# Altium project SDL.PrjPcb
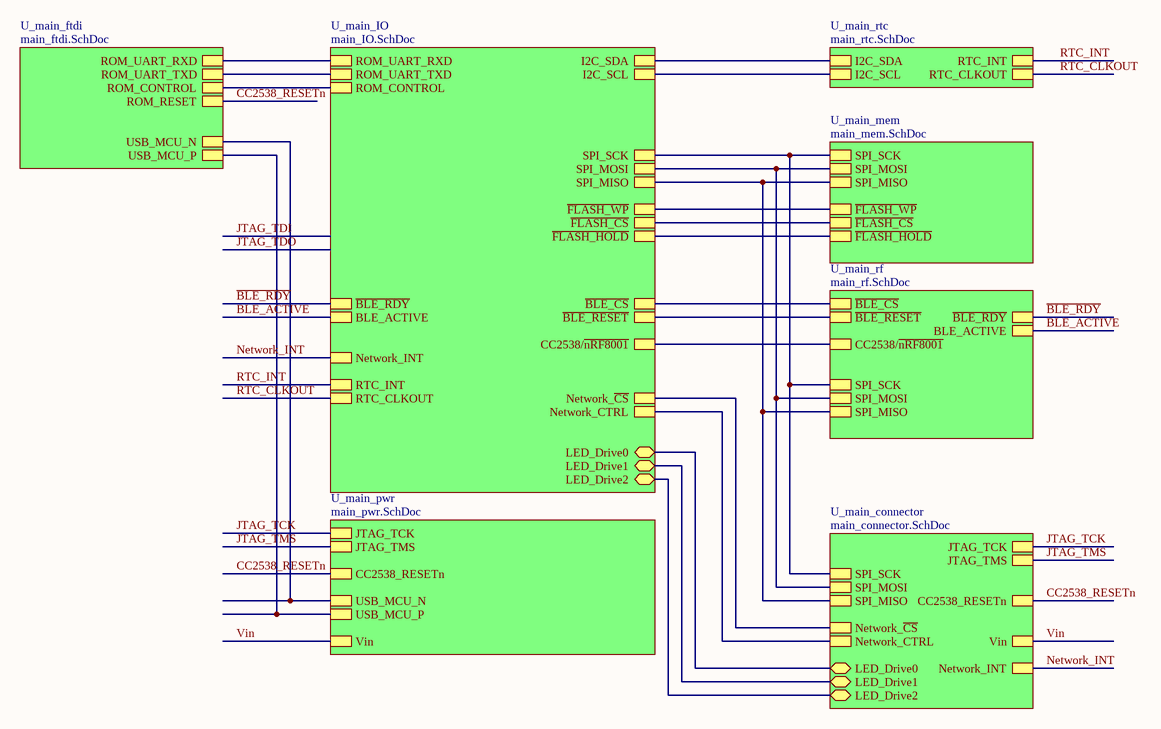
[diagram p0: main_top.SchDoc]
8 sheets, 101 parts. Net scope: hierarchical (ports join the sheet entries above them; power ports are global).
Board file: main.PcbDoc
Sheets:
  main_top.SchDoc
    U_main_connector = main_connector.SchDoc
    U_main_ftdi = main_ftdi.SchDoc
    U_main_IO = main_IO.SchDoc
    U_main_mem = main_mem.SchDoc
    U_main_pwr = main_pwr.SchDoc
    U_main_rf = main_rf.SchDoc
    U_main_rtc = main_rtc.SchDoc

## Sheet main_top.SchDoc: SDL - Main
size Letter; Author: Ye-Sheng Kuo; Revision: 1; SheetNumber: 1; SheetTotal: 8

### Sub-sheets
U_main_connector = main_connector.SchDoc: Vin, JTAG_TCK, JTAG_TMS, CC2538_RESETn, SPI_SCK, SPI_MOSI, SPI_MISO, Network_~{CS}, Network_CTRL, Network_INT, LED_Drive0, LED_Drive1, LED_Drive2
U_main_ftdi = main_ftdi.SchDoc: ROM_UART_RXD, ROM_UART_TXD, ROM_CONTROL, ROM_RESET, USB_MCU_N, USB_MCU_P
U_main_IO = main_IO.SchDoc: ROM_UART_RXD, ROM_UART_TXD, ROM_CONTROL, I2C_SDA, I2C_SCL, SPI_SCK, SPI_MOSI, SPI_MISO, ~{FLASH_WP}, ~{FLASH_CS}, ~{FLASH_HOLD}, ~{BLE_RDY}, ~{BLE_CS}, BLE_ACTIVE, ~{BLE_RESET}, RTC_INT, RTC_CLKOUT, CC2538/~{nRF8001}, Network_~{CS}, Network_CTRL, Network_INT, LED_Drive0, LED_Drive1, LED_Drive2
U_main_mem = main_mem.SchDoc: ~{FLASH_WP}, ~{FLASH_CS}, ~{FLASH_HOLD}, SPI_SCK, SPI_MOSI, SPI_MISO
U_main_pwr = main_pwr.SchDoc: Vin, CC2538_RESETn, USB_MCU_N, USB_MCU_P, JTAG_TCK, JTAG_TMS
U_main_rf = main_rf.SchDoc: SPI_SCK, SPI_MOSI, SPI_MISO, ~{BLE_RDY}, ~{BLE_CS}, BLE_ACTIVE, ~{BLE_RESET}, CC2538/~{nRF8001}
U_main_rtc = main_rtc.SchDoc: RTC_CLKOUT, I2C_SDA, I2C_SCL, RTC_INT

### Nets
~{BLE_CS}: sheet U_main_IO/~{BLE_CS}, sheet U_main_rf/~{BLE_CS}
~{BLE_RDY}: sheet U_main_IO/~{BLE_RDY}, sheet U_main_rf/~{BLE_RDY}
~{BLE_RESET}: sheet U_main_IO/~{BLE_RESET}, sheet U_main_rf/~{BLE_RESET}
BLE_ACTIVE: sheet U_main_IO/BLE_ACTIVE, sheet U_main_rf/BLE_ACTIVE
CC2538/~{nRF8001}: sheet U_main_IO/CC2538/~{nRF8001}, sheet U_main_rf/CC2538/~{nRF8001}
CC2538_RESETn: sheet U_main_connector/CC2538_RESETn, sheet U_main_ftdi/ROM_RESET, sheet U_main_pwr/CC2538_RESETn
~{FLASH_CS}: sheet U_main_IO/~{FLASH_CS}, sheet U_main_mem/~{FLASH_CS}
~{FLASH_HOLD}: sheet U_main_IO/~{FLASH_HOLD}, sheet U_main_mem/~{FLASH_HOLD}
~{FLASH_WP}: sheet U_main_IO/~{FLASH_WP}, sheet U_main_mem/~{FLASH_WP}
I2C_SCL: sheet U_main_IO/I2C_SCL, sheet U_main_rtc/I2C_SCL
I2C_SDA: sheet U_main_IO/I2C_SDA, sheet U_main_rtc/I2C_SDA
JTAG_TCK: sheet U_main_connector/JTAG_TCK, sheet U_main_pwr/JTAG_TCK
JTAG_TMS: sheet U_main_connector/JTAG_TMS, sheet U_main_pwr/JTAG_TMS
LED_Drive0: sheet U_main_connector/LED_Drive0, sheet U_main_IO/LED_Drive0
LED_Drive1: sheet U_main_connector/LED_Drive1, sheet U_main_IO/LED_Drive1
LED_Drive2: sheet U_main_connector/LED_Drive2, sheet U_main_IO/LED_Drive2
Network_~{CS}: sheet U_main_connector/Network_~{CS}, sheet U_main_IO/Network_~{CS}
Network_CTRL: sheet U_main_connector/Network_CTRL, sheet U_main_IO/Network_CTRL
Network_INT: sheet U_main_connector/Network_INT, sheet U_main_IO/Network_INT
ROM_CONTROL: sheet U_main_ftdi/ROM_CONTROL, sheet U_main_IO/ROM_CONTROL
ROM_UART_RXD: sheet U_main_ftdi/ROM_UART_RXD, sheet U_main_IO/ROM_UART_RXD
ROM_UART_TXD: sheet U_main_ftdi/ROM_UART_TXD, sheet U_main_IO/ROM_UART_TXD
RTC_CLKOUT: sheet U_main_IO/RTC_CLKOUT, sheet U_main_rtc/RTC_CLKOUT
RTC_INT: sheet U_main_IO/RTC_INT, sheet U_main_rtc/RTC_INT
SPI_MISO: sheet U_main_connector/SPI_MISO, sheet U_main_IO/SPI_MISO, sheet U_main_mem/SPI_MISO, sheet U_main_rf/SPI_MISO
SPI_MOSI: sheet U_main_connector/SPI_MOSI, sheet U_main_IO/SPI_MOSI, sheet U_main_mem/SPI_MOSI, sheet U_main_rf/SPI_MOSI
SPI_SCK: sheet U_main_connector/SPI_SCK, sheet U_main_IO/SPI_SCK, sheet U_main_mem/SPI_SCK, sheet U_main_rf/SPI_SCK
USB_MCU_N: sheet U_main_ftdi/USB_MCU_N, sheet U_main_pwr/USB_MCU_N
USB_MCU_P: sheet U_main_ftdi/USB_MCU_P, sheet U_main_pwr/USB_MCU_P
Vin: sheet U_main_connector/Vin, sheet U_main_pwr/Vin

### Notes on the sheet
- Title
- Date:
- Author:
- Revision:
- Sheet
- of
- University of Michigan
- File:

## Sheet main_connector.SchDoc: SDL - Main
size Letter; Author: Ye-Sheng Kuo; Revision: 1; SheetNumber: 6; SheetTotal: 8
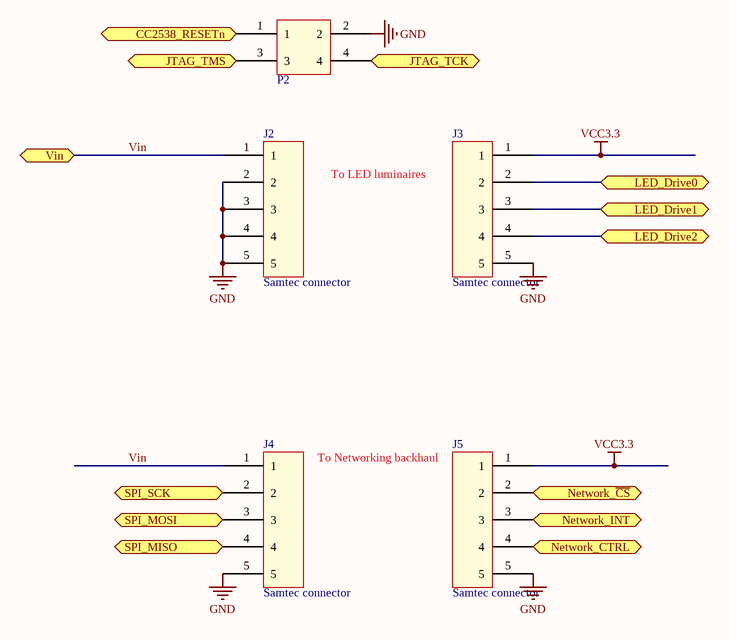
[diagram p1: main_connector.SchDoc]

### Parts
J2  Samtec connector  [SFM-105-02-L-S]
J3  Samtec connector  [SFM-105-02-L-S]
J4  Samtec connector  [SFM-105-02-L-S]
J5  Samtec connector  [SFM-105-02-L-S]
P2  2 x 2 header SMD  [2x2 header SMD]  (value not drawn)

### Ports
CC2538_RESETn, JTAG_TCK, JTAG_TMS, LED_Drive0, LED_Drive1, LED_Drive2, Network_CTRL, Network_INT, Network_~{CS}, SPI_MISO, SPI_MOSI, SPI_SCK, Vin

### Nets
GND: J2.2 J2.3 J2.4 J2.5 J3.5 J4.5 J5.5 P2.2
VCC3.3: J3.1 J5.1
CC2538_RESETn: P2.1 ; port CC2538_RESETn
JTAG_TCK: P2.4 ; port JTAG_TCK
JTAG_TMS: P2.3 ; port JTAG_TMS
LED_Drive0: J3.2 ; port LED_Drive0
LED_Drive1: J3.3 ; port LED_Drive1
LED_Drive2: J3.4 ; port LED_Drive2
Network_~{CS}: J5.2 ; port Network_~{CS}
Network_CTRL: J5.4 ; port Network_CTRL
Network_INT: J5.3 ; port Network_INT
SPI_MISO: J4.4 ; port SPI_MISO
SPI_MOSI: J4.3 ; port SPI_MOSI
SPI_SCK: J4.2 ; port SPI_SCK
Vin: J2.1 J4.1 ; port Vin

### Notes on the sheet
- To LED luminaires
- To Networking backhaul
- Title
- Date:
- Author:
- Revision:
- Sheet
- of
- University of Michigan
- File:

### Library data of the parts
J2-J5 = Samtec conntector: Samtec connector, 1.27 mm, single row, 5 pos SMD; Supplier 1: Samtec
P2 = 2 x 2 header SMD: 2x2 100 mil header SMD; Supplier 1: Digi-Key; Supplier Part Number 1: 609-4463-6-ND

## Sheet main_ftdi.SchDoc: SDL - Main
size Letter; Author: Ye-Sheng Kuo; Revision: 1; SheetNumber: 5; SheetTotal: 8
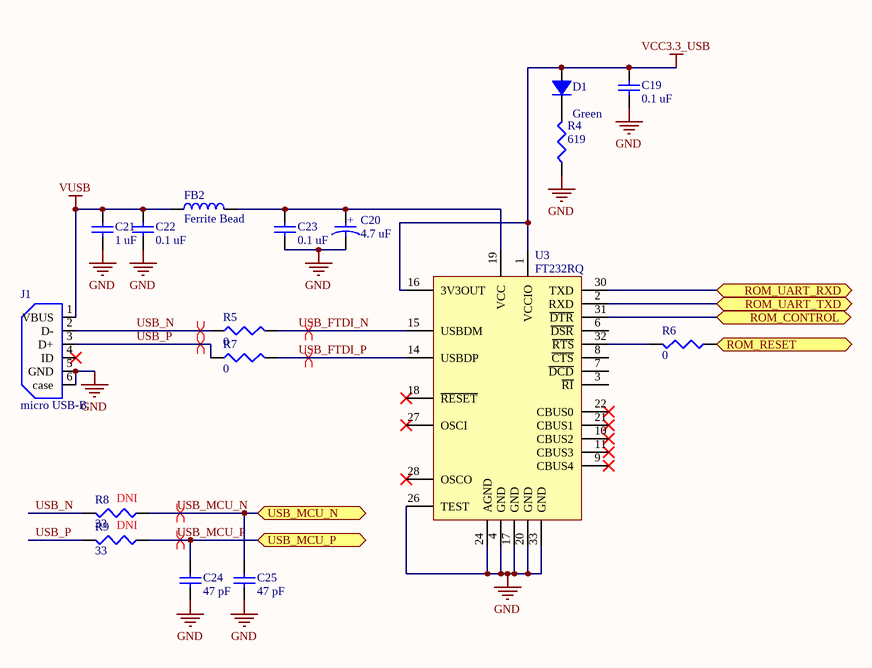
[diagram p2: main_ftdi.SchDoc]

### Parts
C19  value 0.1 uF  [0402]  (hidden comment: Ceramic capacitor)
C20  value 4.7 uF  [0603 - Polar Marking]  (hidden comment: Tantalum capacitor)
C21  value 1 uF  [0402]  (hidden comment: Ceramic capacitor)
C22  value 0.1 uF  [0402]  (hidden comment: Ceramic capacitor)
C23  value 0.1 uF  [0402]  (hidden comment: Ceramic capacitor)
C24  value 47 pF  [0402]  (hidden comment: Ceramic capacitor)
C25  value 47 pF  [0402]  (hidden comment: Ceramic capacitor)
D1  Color: Green  [0402 - DIODE]  (hidden comment: LED, Green)
FB2  Ferrite Bead  [0402]
J1  micro USB-B  [Micro USB-B]
R4  value 619  [0402]  (hidden comment: Chip resistor)
R5  value 0  [0402]  (hidden comment: Chip resistor)
R6  value 0  [0402]  (hidden comment: Chip resistor)
R7  value 0  [0402]  (hidden comment: Chip resistor)
R8  value 33  [0402]  (hidden comment: Chip resistor)
R9  value 33  [0402]  (hidden comment: Chip resistor)
U3  FT232RQ  [QFN-32]

### Ports
ROM_CONTROL, ROM_RESET, ROM_UART_RXD, ROM_UART_TXD, USB_MCU_N, USB_MCU_P

### Nets
GND: C19.2 C20.2 C21.2 C22.2 C23.2 C24.2 C25.2 J1.5(GND) J1.6(case) R4.2 U3.4(GND) U3.17(GND) U3.20(GND) U3.24(AGND) U3.26(TEST) U3.33(GND)
VCC3.3_USB: C19.1 D1.1 U3.1(VCCIO) U3.16(3V3OUT)
VUSB: C21.1 C22.1 FB2.2 J1.1(VBUS)
CC2538_RESETn: R6.2 ; port ROM_RESET
ROM_CONTROL: U3.31(~{DTR}) ; port ROM_CONTROL
ROM_UART_RXD: U3.30(TXD) ; port ROM_UART_RXD
ROM_UART_TXD: U3.2(RXD) ; port ROM_UART_TXD
USB_FTDI_N: R5.1 U3.15(USBDM)
USB_FTDI_P: R7.1 U3.14(USBDP)
USB_MCU_N: C25.1 R8.2 ; port USB_MCU_N
USB_MCU_P: C24.1 R9.2 ; port USB_MCU_P
USB_N: J1.2(D-) R5.2 R8.1
USB_P: J1.3(D+) R7.2 R9.1
NetC20_1: C20.1 C23.1 FB2.1 U3.19(VCC)
NetD1_2: D1.2 R4.1
NetR6_1: R6.1 U3.32(~{RTS})

Not connected (* = marked no-connect by the designer): J1 4(ID)*; U3 3(~{RI}) 6(~{DSR}) 7(~{DCD}) 8(~{CTS}) 9(CBUS4)* 10(CBUS2)* 11(CBUS3)* 18(~{RESET})* 21(CBUS1)* 22(CBUS0)* 27(OSCI)* 28(OSCO)*

### Layout directives
differential pair: USB_FTDI_N, USB_FTDI_P, USB_MCU_N, USB_MCU_P, USB_N, USB_P

### Notes on the sheet
- (near R8) DNI
- DNI
- Title
- Date:
- Author:
- Revision:
- Sheet
- of
- University of Michigan
- File:
- (in symbol C_4.7u_0603_tantalum) +

### Library data of the parts
C19 C22 C23 = C_0.1u_0402_ceramic: Ceramic capacitor, 0.1u, 0402 package; Manufacture: TDK; voltage rated: 10 V; tolerance: 10%; Supplier 1: Digi-Key; Supplier Part Number 1: 445-1265-1-ND; package: 0402
C20 = C_4.7u_0603_tantalum: Tantalum capacitor, 4.7 uF, 0603 package; Manufacture: Rohm; voltage rated: 10 V; tolerance: 20%; package: 0603; Supplier 1: Digi-Key; Supplier Part Number 1: 511-1496-1-ND
C21 = C_1u_0402_ceramic: Ceramic capacitor, 1 uF, 0402 package; Manufacture: TDK; voltage rated: 6.3 V; tolerance: 10%; package: 0402; Supplier 1: Digi-Key; Supplier Part Number 1: 445-5000-1-ND
C24 C25 = C_47p_0402_ceramic: Ceramic capacitor, 47 pF, 0402 package; Manufacture: Johanson; voltage rated: 50 V; tolerance: 5%; package: 0402; Supplier 1: Digi-Key; Supplier Part Number 1: 709-1121-1-ND
D1 = D_LED_GREEN_0402: LED, Green,  0402; package: 0402; Supplier 1: Digi-Key; Supplier Part Number 1: 511-1592-1-ND
FB2 = FB_150mA_0402: Ferrite Bead, 150 mA, 0402 package; impedance@Freq: 1K@100 MHz; current rating: 150 mA; Supplier 1: Digi-Key; Supplier Part Number 1: 587-1835-1-ND; package: 0402
J1 = Micro USB: CONN USB MICRO B RECPT SMT R/A; Supplier 1: Digi-Key; Supplier Part Number 1: 609-4616-6-ND
R4 = R_619_0402: Chip resistor, 619, 0402 package; tolerance: 1%; power: 1/16 W; package: 0402; Supplier 1: Digi-Key; Supplier Part Number 1: 541-619LCT-ND
R5-R7 = R_0_0402: Chip resistor, 0, 0402 package; package: 0402; Supplier 1: Digi-Key; Supplier Part Number 1: 541-0.0YBCT-ND
R8 R9 = R_33_0402: Chip resistor, 33, 0402 package; tolerance: 1%; power: 1/16 W; package: 0402; Supplier 1: Digi-Key; Supplier Part Number 1: 541-33.0LCT-ND
U3 = FT232RQ: FT232R USB UART; Manufacturer: *; Note: *; ManufacturerPartNo: *; Supplier 1: Digi-Key; Supplier Part Number 1: 768-1008-1-ND

## Sheet main_IO.SchDoc: SDL - Main
size Letter; Author: Ye-Sheng Kuo; Revision: 1; SheetNumber: 4; SheetTotal: 8
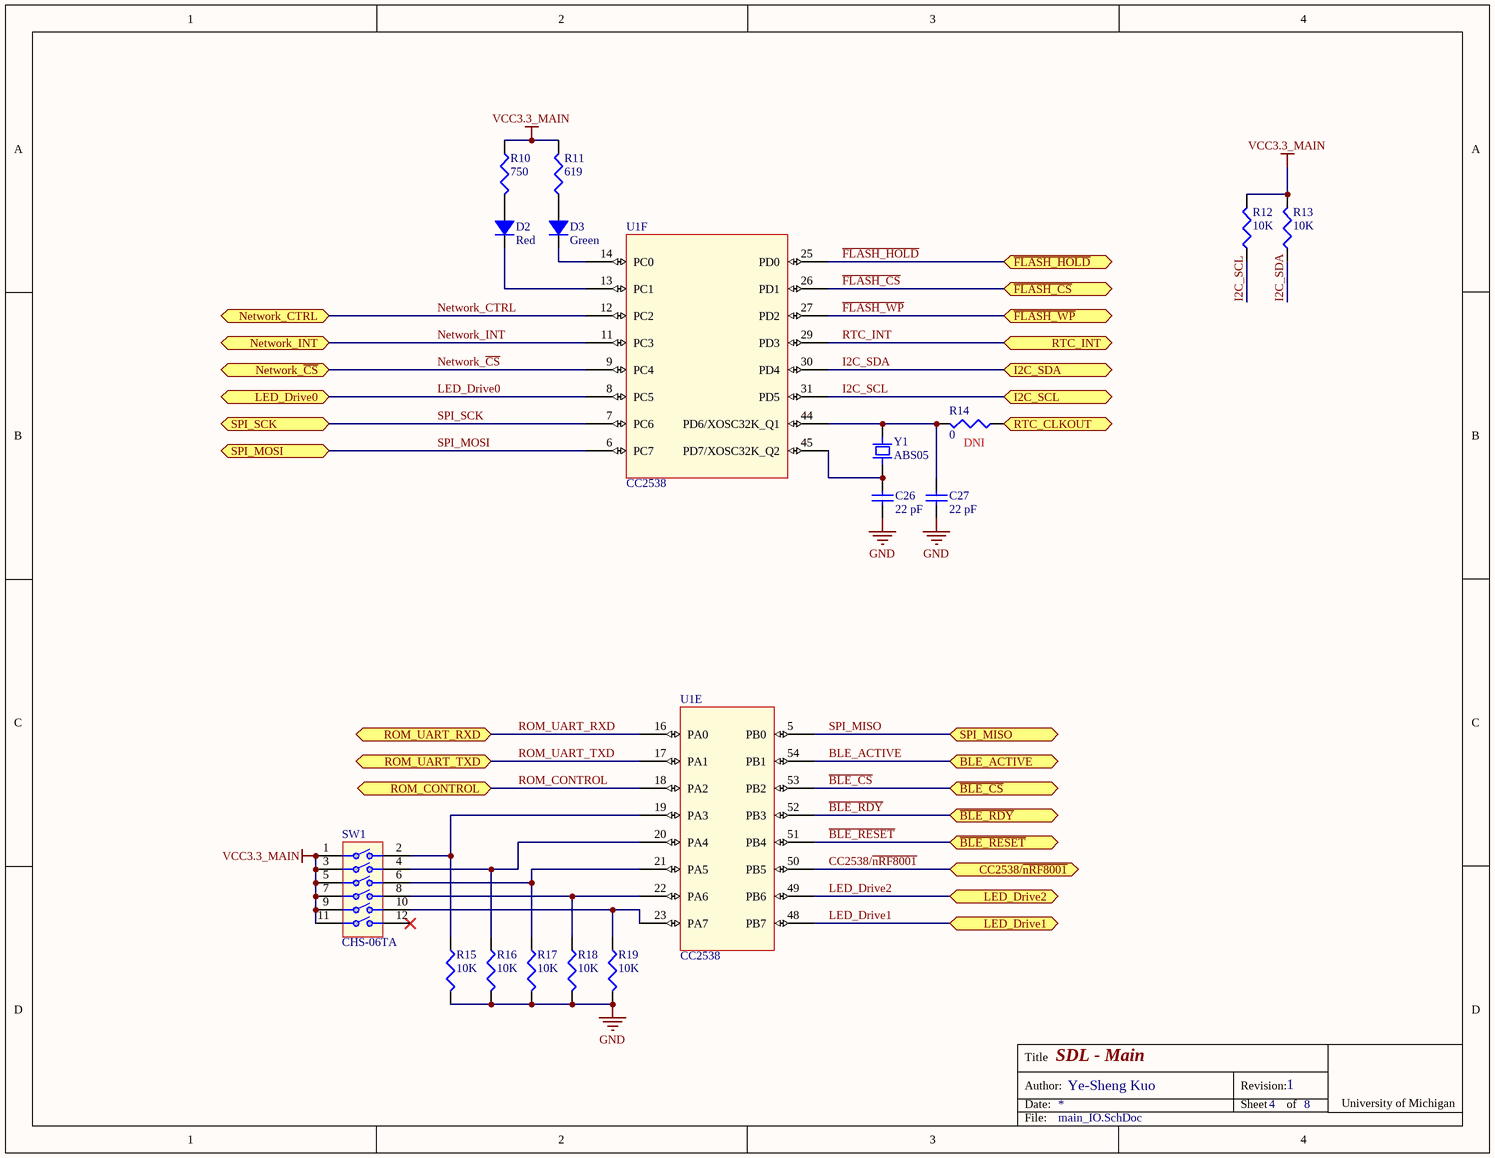
[diagram p3: main_IO.SchDoc]

### Parts
C26  value 22 pF  [0402]  (hidden comment: Ceramic capacitor)
C27  value 22 pF  [0402]  (hidden comment: Ceramic capacitor)
D2  Color: Red  [0402 - DIODE]  (hidden comment: LED, Red)
D3  Color: Green  [0402 - DIODE]  (hidden comment: LED, Green)
R10  value 750  [0402]  (hidden comment: Chip resistor)
R11  value 619  [0402]  (hidden comment: Chip resistor)
R12  value 10K  [0402]  (hidden comment: Chip resistor)
R13  value 10K  [0402]  (hidden comment: Chip resistor)
R14  value 0  [0402]  (hidden comment: Chip resistor)
R15  value 10K  [0402]  (hidden comment: Chip resistor)
R16  value 10K  [0402]  (hidden comment: Chip resistor)
R17  value 10K  [0402]  (hidden comment: Chip resistor)
R18  value 10K  [0402]  (hidden comment: Chip resistor)
R19  value 10K  [0402]  (hidden comment: Chip resistor)
SW1  CHS-06TA  [CHS-06TA]
U1  CC2538  [QFN56]  (parts E,F of 6)
Y1  ABS05  [ABS05]

### Ports
BLE_ACTIVE, CC2538/~{nRF8001}, I2C_SCL, I2C_SDA, LED_Drive0, LED_Drive1, LED_Drive2, Network_CTRL, Network_INT, Network_~{CS}, ROM_CONTROL, ROM_UART_RXD, ROM_UART_TXD, RTC_CLKOUT, RTC_INT, SPI_MISO, SPI_MOSI, SPI_SCK, ~{BLE_CS}, ~{BLE_RDY}, ~{BLE_RESET}, ~{FLASH_CS}, ~{FLASH_HOLD}, ~{FLASH_WP}

### Nets
GND: C26.2 C27.2 R15.1 R16.1 R17.1 R18.1 R19.1
VCC3.3_MAIN: R10.2 R11.1 R12.1 R13.1 SW1.1 SW1.3 SW1.5 SW1.7 SW1.9 SW1.11
~{BLE_CS}: U1.53(PB2) ; port ~{BLE_CS}
~{BLE_RDY}: U1.52(PB3) ; port ~{BLE_RDY}
~{BLE_RESET}: U1.51(PB4) ; port ~{BLE_RESET}
BLE_ACTIVE: U1.54(PB1) ; port BLE_ACTIVE
CC2538/~{nRF8001}: U1.50(PB5) ; port CC2538/~{nRF8001}
~{FLASH_CS}: U1.26(PD1) ; port ~{FLASH_CS}
~{FLASH_HOLD}: U1.25(PD0) ; port ~{FLASH_HOLD}
~{FLASH_WP}: U1.27(PD2) ; port ~{FLASH_WP}
I2C_SCL: R12.2 U1.31(PD5) ; port I2C_SCL
I2C_SDA: R13.2 U1.30(PD4) ; port I2C_SDA
LED_Drive0: U1.8(PC5) ; port LED_Drive0
LED_Drive1: U1.48(PB7) ; port LED_Drive1
LED_Drive2: U1.49(PB6) ; port LED_Drive2
Network_~{CS}: U1.9(PC4) ; port Network_~{CS}
Network_CTRL: U1.12(PC2) ; port Network_CTRL
Network_INT: U1.11(PC3) ; port Network_INT
ROM_CONTROL: U1.18(PA2) ; port ROM_CONTROL
ROM_UART_RXD: U1.16(PA0) ; port ROM_UART_RXD
ROM_UART_TXD: U1.17(PA1) ; port ROM_UART_TXD
RTC_CLKOUT: R14.2 ; port RTC_CLKOUT
RTC_INT: U1.29(PD3) ; port RTC_INT
SPI_MISO: U1.5(PB0) ; port SPI_MISO
SPI_MOSI: U1.6(PC7) ; port SPI_MOSI
SPI_SCK: U1.7(PC6) ; port SPI_SCK
NetC26_1: C26.1 U1.45(PD7/XOSC32K_Q2) Y1.2
NetC27_1: C27.1 R14.1 U1.44(PD6/XOSC32K_Q1) Y1.1
NetD2_1: D2.1 R10.1
NetD2_2: D2.2 U1.13(PC1)
NetD3_1: D3.1 R11.2
NetD3_2: D3.2 U1.14(PC0)
NetR15_2: R15.2 SW1.2 U1.19(PA3)
NetR16_2: R16.2 SW1.4 U1.20(PA4)
NetR17_2: R17.2 SW1.6 U1.21(PA5)
NetR18_2: R18.2 SW1.8 U1.22(PA6)
NetR19_2: R19.2 SW1.10 U1.23(PA7)

Not connected (* = marked no-connect by the designer): SW1 12*

### Notes on the sheet
- (near R14) DNI
- Title
- Date:
- Author:
- Revision:
- Sheet
- of
- University of Michigan
- File:

### Library data of the parts
C26 C27 = C_22p_0402_ceramic: Ceramic capacitor, 22 pF, 0402 package; Manufacture: Johanson; voltage rated: 50 V; tolerance: 2%; package: 0402; Supplier 1: Digi-Key; Supplier Part Number 1: 712-1274-1-ND
D2 = D_LED_RED_0402: LED, Red, 0402; package: 0402; Supplier 1: Digi-Key; Supplier Part Number 1: 511-1593-1-ND
D3 = D_LED_GREEN_0402: LED, Green,  0402; package: 0402; Supplier 1: Digi-Key; Supplier Part Number 1: 511-1592-1-ND
R10 = R_750_0402: Chip resistor, 750, 0402 package; tolerance: 1%; power: 1/16 W; package: 0402; Supplier 1: Digi-Key; Supplier Part Number 1: 541-750LCT-ND
R11 = R_619_0402: as R4 on sheet main_ftdi; package: 0402; Supplier 1: Digi-Key; Supplier Part Number 1: 541-619LCT-ND
R12 R13 R15-R19 = R_10K_0402: Chip resistor, 10K, 0402 package; tolerance: 1%; power: 1/16 W; Supplier 1: Digi-Key; Supplier Part Number 1: 541-10.0KLDKR-ND; package: 0402
R14 = R_0_0402: Chip resistor, 0, 0402 package; package: 0402; Supplier 1: Digi-Key; Supplier Part Number 1: 541-0.0YBCT-ND
SW1 = CHS-06TA: SLIDE SWITCHES; Supplier 1: Digi-Key; Supplier Part Number 1: 563-1009-1-ND
U1 = CC2538: A Powerful System-On-Chip for 2.4-GHz IEEE 802.15.4, 6LoWPAN  and ZigBee Applications; Supplier 1: Digi-Key; Supplier Part Number 1: 296-35797-1-ND
Y1 = ABS05: 32768 Hz SMD Low profile crystal; Supplier 1: Digi-Key; Supplier Part Number 1: 535-11899-1-ND

## Sheet main_mem.SchDoc: SDL - Main
size Letter; Author: Ye-Sheng Kuo; Revision: 1; SheetNumber: 8; SheetTotal: 8
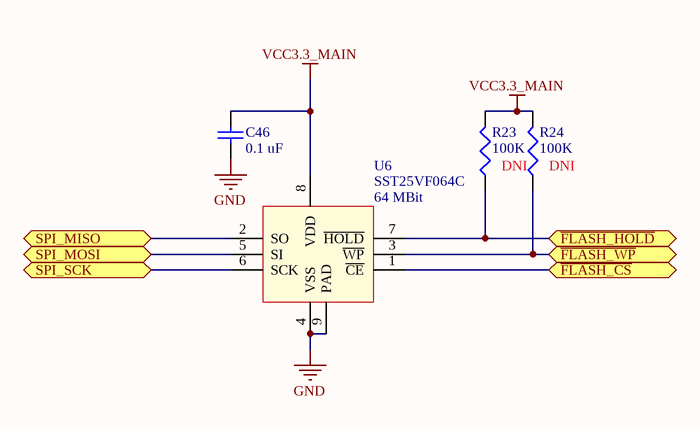
[diagram p4: main_mem.SchDoc]

### Parts
C46  value 0.1 uF  [0402]  (hidden comment: Ceramic capacitor)
R23  value 100K  [0402]  (hidden comment: Chip resistor)
R24  value 100K  [0402]  (hidden comment: Chip resistor)
U6  SST25VF064C  Capacity: 64 MBit  [WSON]

### Ports
SPI_MISO, SPI_MOSI, SPI_SCK, ~{FLASH_CS}, ~{FLASH_HOLD}, ~{FLASH_WP}

### Nets
GND: C46.2 U6.4(VSS) U6.9(PAD)
VCC3.3_MAIN: C46.1 R23.1 R24.1 U6.8(VDD)
~{FLASH_CS}: U6.1(~{CE}) ; port ~{FLASH_CS}
~{FLASH_HOLD}: R23.2 U6.7(~{HOLD}) ; port ~{FLASH_HOLD}
~{FLASH_WP}: R24.2 U6.3(~{WP}) ; port ~{FLASH_WP}
SPI_MISO: U6.2(SO) ; port SPI_MISO
SPI_MOSI: U6.5(SI) ; port SPI_MOSI
SPI_SCK: U6.6(SCK) ; port SPI_SCK

### Notes on the sheet
- DNI
- (near R24) DNI
- Title
- Date:
- Author:
- Revision:
- Sheet
- of
- University of Michigan
- File:

### Library data of the parts
C46 = C_0.1u_0402_ceramic: as C19 on sheet main_ftdi; Supplier 1: Digi-Key; Supplier Part Number 1: 445-1265-1-ND; package: 0402
R23 R24 = R_100K_0402: Chip resistor, 100K, 0402 package; tolerance: 1%; power: 1/16 W; Supplier 1: Digi-Key; Supplier Part Number 1: 541-100KLCT-ND; package: 0402
U6 = SST25VF064C: 64 Mbit SPI Serial Dual I/O Flash; Supplier 1: Digi-Key; Supplier Part Number 1: SST25VF064C-80-4I-Q2AE-CT-ND

## Sheet main_pwr.SchDoc: SDL - Main
size Letter; Author: Ye-Sheng Kuo; Revision: 1; SheetNumber: 2; SheetTotal: 8
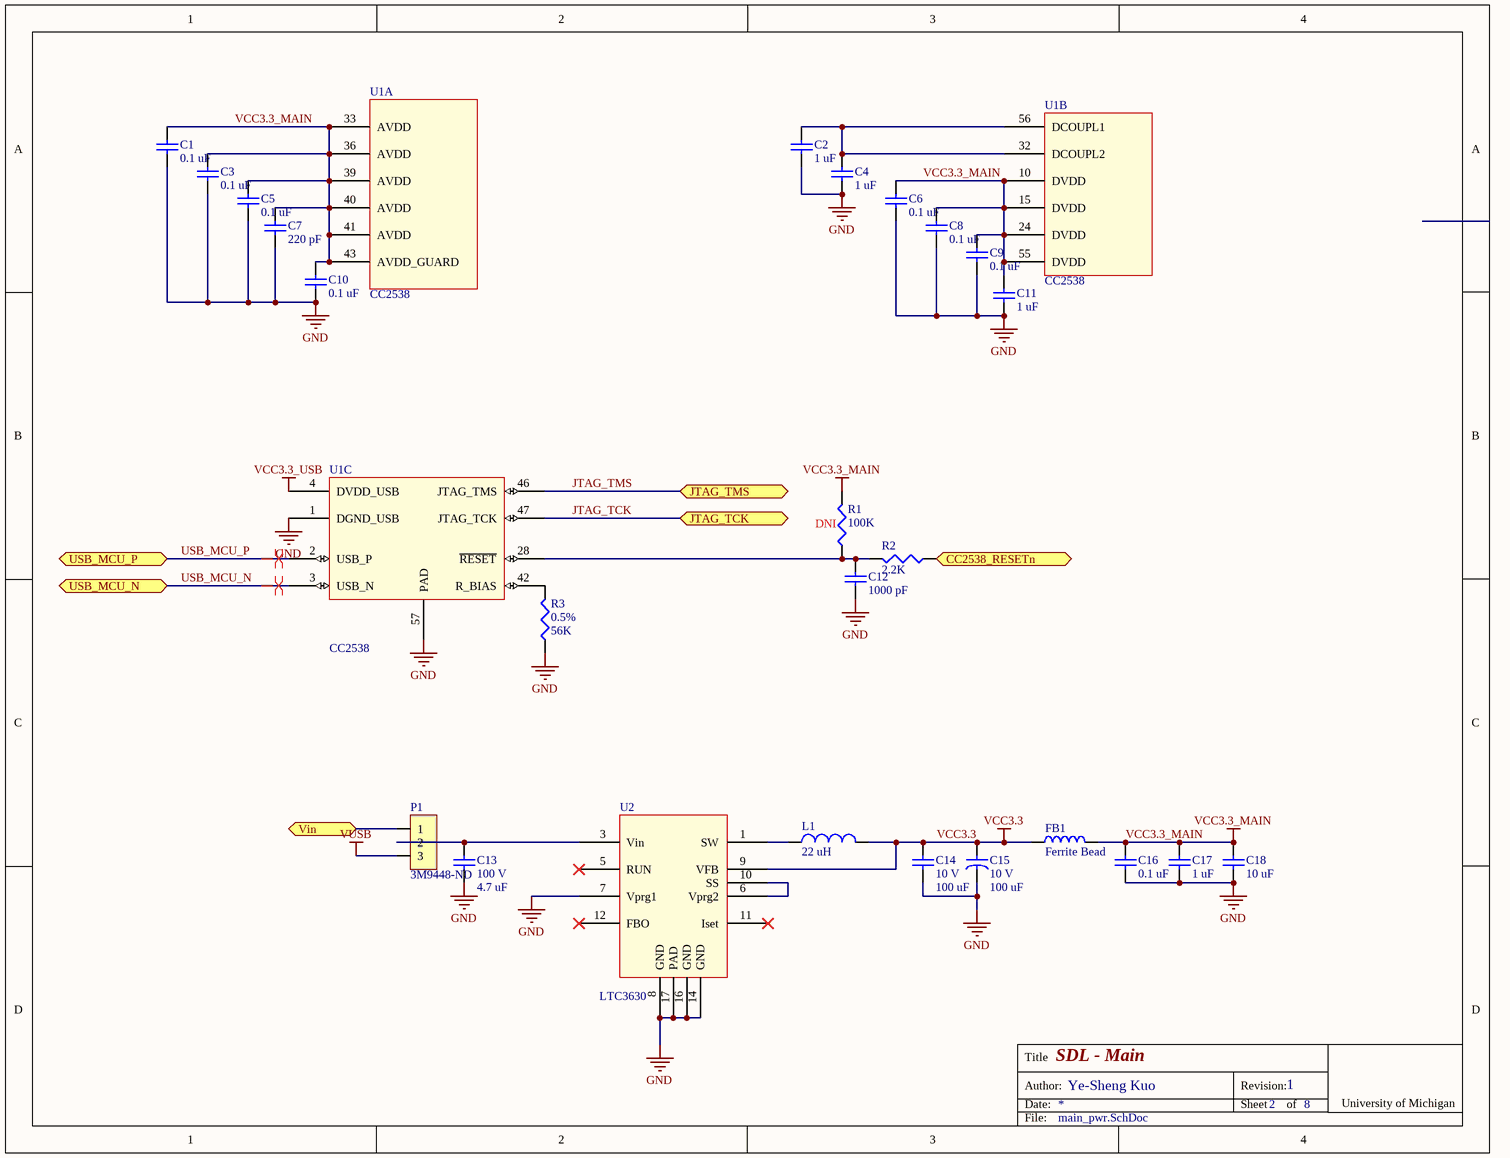
[diagram p5: main_pwr.SchDoc]

### Parts
C1  value 0.1 uF  [0402]  (hidden comment: Ceramic capacitor)
C2  value 1 uF  [0402]  (hidden comment: Ceramic capacitor)
C3  value 0.1 uF  [0402]  (hidden comment: Ceramic capacitor)
C4  value 1 uF  [0402]  (hidden comment: Ceramic capacitor)
C5  value 0.1 uF  [0402]  (hidden comment: Ceramic capacitor)
C6  value 0.1 uF  [0402]  (hidden comment: Ceramic capacitor)
C7  value 220 pF  [0402]  (hidden comment: Ceramic capacitor)
C8  value 0.1 uF  [0402]  (hidden comment: Ceramic capacitor)
C9  value 0.1 uF  [0402]  (hidden comment: Ceramic capacitor)
C10  value 0.1 uF  [0402]  (hidden comment: Ceramic capacitor)
C11  value 1 uF  [0402]  (hidden comment: Ceramic capacitor)
C12  value 1000 pF  [0402]  (hidden comment: Ceramic capacitor)
C13  value 4.7 uF  voltage rated: 100 V  [2220]  (hidden comment: Ceramic capacitor)
C14  value 100 uF  voltage rated: 10 V  [1210]  (hidden comment: Ceramic capacitor)
C15  value 100 uF  voltage rated: 10 V  [2917]  (hidden comment: Ceramic capacitor)
C16  value 0.1 uF  [0402]  (hidden comment: Ceramic capacitor)
C17  value 1 uF  [0402]  (hidden comment: Ceramic capacitor)
C18  value 10 uF  [0603]  (hidden comment: Ceramic capacitor)
FB1  Ferrite Bead  [0402]
L1  value 22 uH  [SLF10145]  (hidden comment: L_22uH_SLF10145)
P1  Supplier Part Number 1: 3M9448-ND  [1x3 header]  (hidden comment: 1 x 3 header)
R1  value 100K  [0402]  (hidden comment: Chip resistor)
R2  value 2.2K  [0402]  (hidden comment: Chip resistor)
R3  value 56K  tolerance: 0.5%  [0402]  (hidden comment: Chip resistor)
U1  CC2538  [QFN56]  (parts A,B,C of 6)
U2  LTC3630  [MSE16(12)]

### Ports
CC2538_RESETn, JTAG_TCK, JTAG_TMS, USB_MCU_N, USB_MCU_P, Vin

### Nets
GND: C1.2 C2.2 C3.2 C4.2 C5.2 C6.2 C7.2 C8.2 C9.2 C10.2 C11.2 C12.2 C13.2 C14.2 C15.2 C16.2 C17.2 C18.2 R3.2 U1.1(DGND_USB) U1.57(PAD) U2.7(Vprg1) U2.8(GND) U2.14(GND) U2.16(GND) U2.17(PAD)
VCC3.3: C14.1 C15.1 FB1.2 L1.1 U2.9(VFB)
VCC3.3_MAIN: C1.1 C3.1 C5.1 C6.1 C7.1 C8.1 C9.1 C10.1 C11.1 C16.1 C17.1 C18.1 FB1.1 R1.1 U1.10(DVDD) U1.15(DVDD) U1.24(DVDD) U1.33(AVDD) U1.36(AVDD) U1.39(AVDD) U1.40(AVDD) U1.41(AVDD) U1.43(AVDD_GUARD) U1.55(DVDD)
VCC3.3_USB: U1.4(DVDD_USB)
VUSB: P1.3
CC2538_RESETn: R2.2 ; port CC2538_RESETn
JTAG_TCK: U1.47(JTAG_TCK) ; port JTAG_TCK
JTAG_TMS: U1.46(JTAG_TMS) ; port JTAG_TMS
USB_MCU_N: U1.3(USB_N) ; port USB_MCU_N
USB_MCU_P: U1.2(USB_P) ; port USB_MCU_P
Vin: P1.1 ; port Vin
NetC2_1: C2.1 C4.1 U1.32(DCOUPL2) U1.56(DCOUPL1)
NetC12_1: C12.1 R1.2 R2.1 U1.28(~{RESET})
NetC13_1: C13.1 P1.2 U2.3(Vin)
NetL1_2: L1.2 U2.1(SW)
NetR3_1: R3.1 U1.42(R_BIAS)
NetU2_6: U2.6(Vprg2) U2.10(SS)

Not connected (* = marked no-connect by the designer): U2 5(RUN)* 11(Iset)* 12(FBO)*

### Layout directives
differential pair: USB_MCU_N, USB_MCU_P

### Notes on the sheet
- (near R1) DNI
- Title
- Date:
- Author:
- Revision:
- Sheet
- of
- University of Michigan
- File:

### Library data of the parts
C1 C3 C5 C6 C8-C10 C16 = C_0.1u_0402_ceramic: as C19 on sheet main_ftdi; Supplier 1: Digi-Key; Supplier Part Number 1: 445-1265-1-ND; package: 0402
C2 C4 C11 C17 = C_1u_0402_ceramic: as C21 on sheet main_ftdi; package: 0402; Supplier 1: Digi-Key; Supplier Part Number 1: 445-5000-1-ND
C7 = C_220p_0402_ceramic: Ceramic capacitor, 220 pF, 0402 package; Manufacture: Johanson; voltage rated: 50 V; tolerance: 10%; package: 0402; Temperature: X7R; Supplier 1: Digi-Key; Supplier Part Number 1: 445-1254-1-ND
C12 = C_1000p_0402_ceramic: Ceramic capacitor, 1000 pF, 0402 package; Manufacture: TDK; voltage rated: 50 V; tolerance: 10%; package: 0402; Supplier 1: Digi-Key; Supplier Part Number 1: 445-6846-1-ND
C13 = C_4.7u_2220_ceramic: Ceramic capacitor, 4.7u, 2220 package; Manufacture: TDK; tolerance: 20%; Temp rating: X7R; package: 2220; Supplier 1: Digi-Key; Supplier Part Number 1: 445-1450-1-ND
C14 = C_100u_1210_ceramic: Ceramic capacitor, 100u, 1210 package; Manufacture: Samsung; tolerance: 20%; package: 2917; Supplier 1: Digi-Key; Supplier Part Number 1: 1276-3364-1-ND
C15 = C_100u_2917_tantalum: Tantalum capacitor, 100u, 2917 package; Manufacture: Kemet; tolerance: 10%; package: 2917; Supplier 1: Digi-Key; Supplier Part Number 1: 399-3769-1-ND
C18 = C_10u_0603_ceramic: Ceramic capacitor, 10 uF, 0603 package; Manufacture: TDK; voltage rated: 6.3V; tolerance: 20%; package: 0603; Supplier 1: Digi-Key; Supplier Part Number 1: 445-4112-1-ND
FB1 = FB_150mA_0402: as FB2 on sheet main_ftdi; Supplier 1: Digi-Key; Supplier Part Number 1: 587-1835-1-ND; package: 0402
L1 = L_22uH_SLF10145: Inductor, 22 uH, TDK SLF10145; Saturation current: 2.1 A; Supplier 1: Digi-Key; Supplier Part Number 1: 445-1981-1-ND
P1 = 1 x 3 header: 100 mils standard header; Supplier 1: Digi-Key
R1 = R_100K_0402: as R23 on sheet main_mem; Supplier 1: Digi-Key; Supplier Part Number 1: 541-100KLCT-ND; package: 0402
R2 = R_2.2K_0402: Chip resistor, 2.2K, 0402 package; tolerance: 1%; power: 1/16 W; package: 0402; Supplier 1: Digi-Key; Supplier Part Number 1: 541-2.20KLCT-ND
R3 = R_56K_0402: Chip resistor, 56K, 0402 package; power: 1/16 W; Temperature coefficient: 25 ppm/C; package: 0402; Supplier 1: Digi-Key; Supplier Part Number 1: P56KDECT-ND
U1 = CC2538: as U1 on sheet main_IO; Supplier 1: Digi-Key; Supplier Part Number 1: 296-35797-1-ND
U2 = LTC3630: High Efficiency, 65V 500mA synchronous Step-Down Converter; Supplier 1: Digi-Key; Supplier Part Number 1: LTC3630EMSE#PBF-ND

## Sheet main_rf.SchDoc: SDL - Main
size Letter; Author: Ye-Sheng Kuo; Revision: 1; SheetNumber: 3; SheetTotal: 8
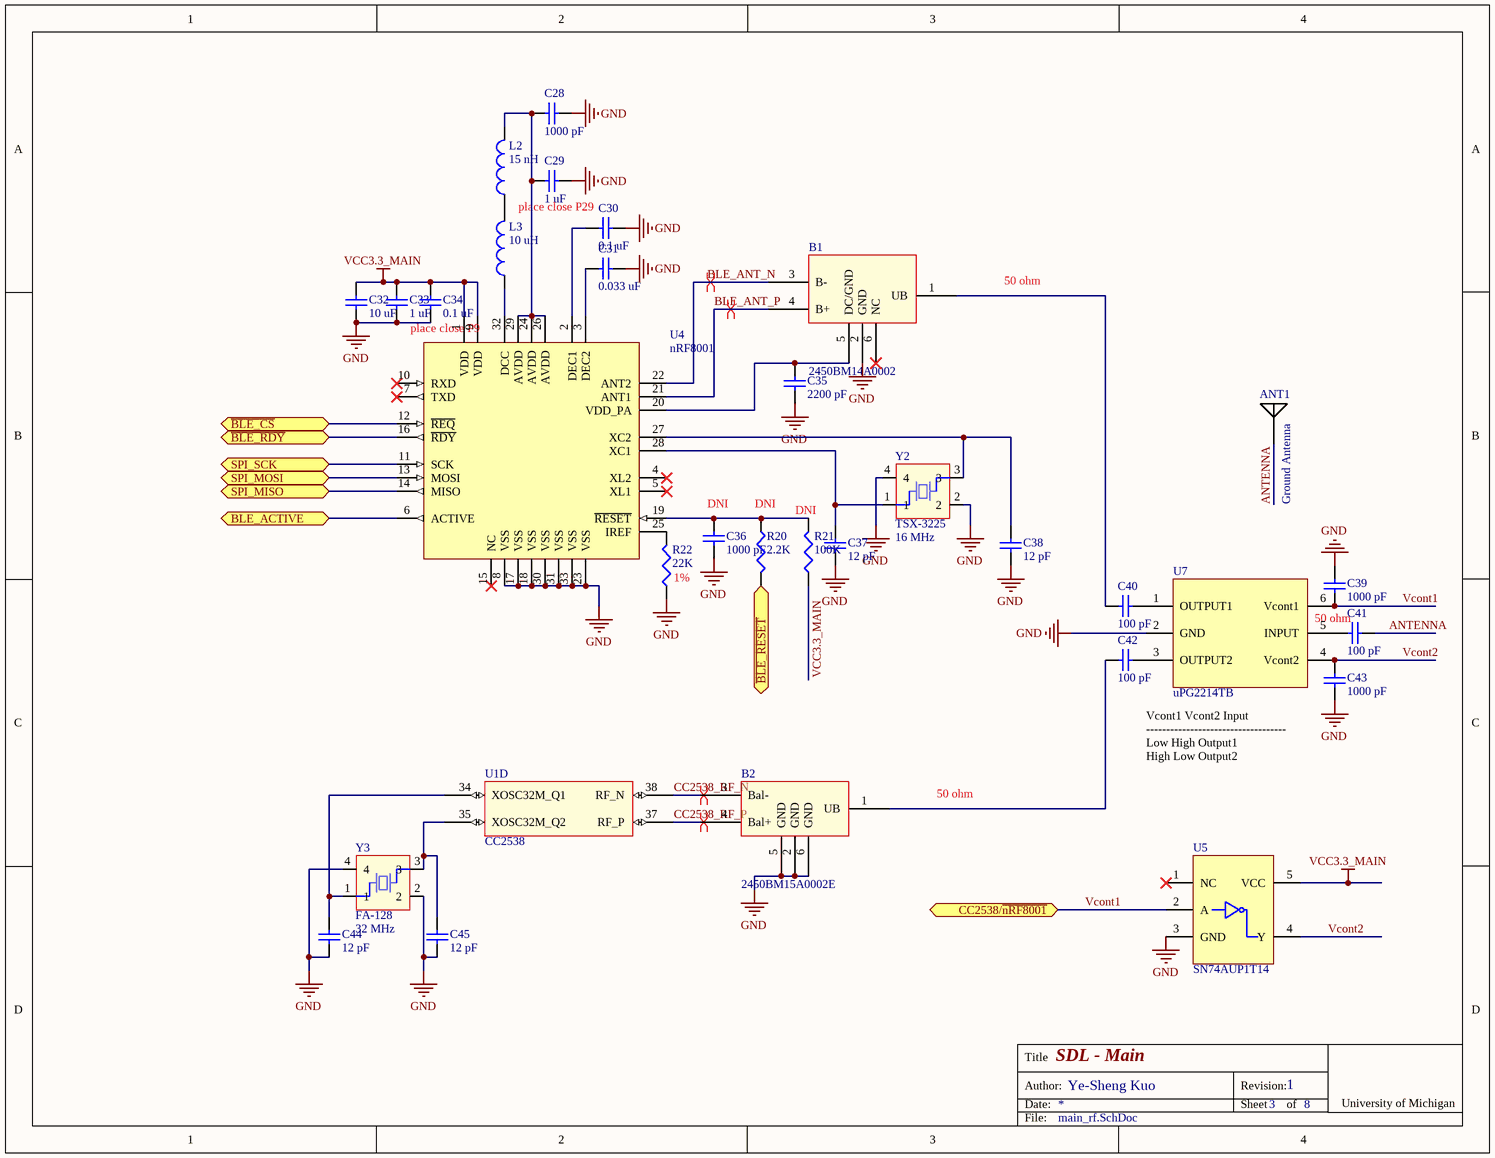
[diagram p6: main_rf.SchDoc]

### Parts
ANT1  Ground Antenna  [Chip Antenna]
B1  2450BM14A0002  [2450BM14A0002]
B2  2450BM15A0002E  [2450BM15A0002]
C28  value 1000 pF  [0402]  (hidden comment: Ceramic capacitor)
C29  value 1 uF  [0603]  (hidden comment: Ceramic capacitor)
C30  value 0.1 uF  [0402]  (hidden comment: Ceramic capacitor)
C31  value 0.033 uF  [0402]  (hidden comment: Ceramic capacitor)
C32  value 10 uF  [0603]  (hidden comment: Ceramic capacitor)
C33  value 1 uF  [0402]  (hidden comment: Ceramic capacitor)
C34  value 0.1 uF  [0402]  (hidden comment: Ceramic capacitor)
C35  value 2200 pF  [0402]  (hidden comment: Ceramic capacitor)
C36  value 1000 pF  [0402]  (hidden comment: Ceramic capacitor)
C37  value 12 pF  [0402]  (hidden comment: Ceramic capacitor)
C38  value 12 pF  [0402]  (hidden comment: Ceramic capacitor)
C39  value 1000 pF  [0402]  (hidden comment: Ceramic capacitor)
C40  value 100 pF  [0402]  (hidden comment: Ceramic capacitor)
C41  value 100 pF  [0402]  (hidden comment: Ceramic capacitor)
C42  value 100 pF  [0402]  (hidden comment: Ceramic capacitor)
C43  value 1000 pF  [0402]  (hidden comment: Ceramic capacitor)
C44  value 12 pF  [0402]  (hidden comment: Ceramic capacitor)
C45  value 12 pF  [0402]  (hidden comment: Ceramic capacitor)
L2  value 15 nH  [0402]  (hidden comment: Chip inductor)
L3  value 10 uH  [0603]  (hidden comment: Chip inductor)
R20  value 2.2K  [0402]  (hidden comment: Chip resistor)
R21  value 100K  [0402]  (hidden comment: Chip resistor)
R22  value 22K  [0402]  (hidden comment: Chip resistor)
U1  CC2538  [QFN56]  (part D of 6)
U4  nRF8001  [QFN32]
U5  SN74AUP1T14  [SC-70-5 (DCK)]
U7  uPG2214TB  [minimold-6]
Y2  TSX-3225  frequency: 16 MHz  [TSX-3225]
Y3  FA-128  frequency: 32 MHz  [FA-128]

### Ports
BLE_ACTIVE, CC2538/~{nRF8001}, SPI_MISO, SPI_MOSI, SPI_SCK, ~{BLE_CS}, ~{BLE_RDY}, ~{BLE_RESET}

### Nets
GND: B1.2(GND) B2.2(GND) B2.5(GND) B2.6(GND) C28.2 C29.2 C30.2 C31.2 C32.2 C33.2 C34.2 C35.2 C36.2 C37.2 C38.2 C39.1 C43.2 C44.1 C45.1 R22.2 U4.8(VSS) U4.17(VSS) U4.18(VSS) U4.23(VSS) U4.30(VSS) U4.31(VSS) U4.33(VSS) U5.3(GND) U7.2(GND) Y2.2 Y2.4 Y3.2 Y3.4
VCC3.3_MAIN: C32.1 C33.1 C34.1 R21.2 U4.1(VDD) U4.9(VDD) U5.5(VCC)
ANTENNA: ANT1.1 C41.2
~{BLE_CS}: U4.12(~{REQ}) ; port ~{BLE_CS}
~{BLE_RDY}: U4.16(~{RDY}) ; port ~{BLE_RDY}
~{BLE_RESET}: R20.1 ; port ~{BLE_RESET}
BLE_ACTIVE: U4.6(ACTIVE) ; port BLE_ACTIVE
BLE_ANT_N: B1.3(B-) U4.22(ANT2)
BLE_ANT_P: B1.4(B+) U4.21(ANT1)
CC2538_RF_N: B2.3(Bal-) U1.38(RF_N)
CC2538_RF_P: B2.4(Bal+) U1.37(RF_P)
SPI_MISO: U4.14(MISO) ; port SPI_MISO
SPI_MOSI: U4.13(MOSI) ; port SPI_MOSI
SPI_SCK: U4.11(SCK) ; port SPI_SCK
Vcont1: C39.2 U5.2(A) U7.6(Vcont1) ; port CC2538/~{nRF8001}  [project net CC2538/~{nRF8001}]
Vcont2: C43.1 U5.4(Y) U7.4(Vcont2)
NetB1_1: B1.1(UB) C40.1
NetB1_5: B1.5(DC/GND) C35.1 U4.20(VDD_PA)
NetB2_1: B2.1(UB) C42.1
NetC28_1: C28.1 C29.1 L2.1 U4.24(AVDD) U4.26(AVDD) U4.29(AVDD)
NetC30_1: C30.1 U4.2(DEC1)
NetC31_1: C31.1 U4.3(DEC2)
NetC36_1: C36.1 R20.2 R21.1 U4.19(~{RESET})
NetC37_1: C37.1 U4.28(XC1) Y2.1
NetC38_1: C38.1 U4.27(XC2) Y2.3
NetC40_2: C40.2 U7.1(OUTPUT1)
NetC41_1: C41.1 U7.5(INPUT)
NetC42_2: C42.2 U7.3(OUTPUT2)
NetC44_2: C44.2 U1.34(XOSC32M_Q1) Y3.1
NetC45_2: C45.2 U1.35(XOSC32M_Q2) Y3.3
NetL2_2: L2.2 L3.1
NetL3_2: L3.2 U4.32(DCC)
NetR22_1: R22.1 U4.25(IREF)

Not connected (* = marked no-connect by the designer): B1 6(NC)*; U4 4(XL2)* 5(XL1)* 7(TXD)* 10(RXD)* 15(NC)*; U5 1(NC)*

### Layout directives
differential pair: BLE_ANT_N, BLE_ANT_P, CC2538_RF_N, CC2538_RF_P

### Notes on the sheet
- place close P29
- 50 ohm
- place close P9
- (near C36) DNI
- (near R20) DNI
- (near R21) DNI
- (near R22) 1%
- (near C43) Vcont1	Vcont2	Input
  -----------------------------------
  Low	High	Output1
  High	Low	Output2
- Title
- Date:
- Author:
- Revision:
- Sheet
- of
- University of Michigan
- File:

### Library data of the parts
ANT1 = Ground Antenna: 2.4GHz Surface Mount Device (SMD) On Ground Antenna, 50 Ohms; Supplier 1: RichardsonRFPD; Supplier Part Number 1: FR05-S1-N-0102B
B1 = 2450BM14A0002: 2.45 GHz Balun for nRF8001; Supplier 1: Digi-Key; Supplier Part Number 1: 712-1574-1-ND
B2 = 2450BM15A0002E: 2.45 GHz Balun for TI CC253X; Supplier 1: Digi-Key; Supplier Part Number 1: 712-1536-1-ND
C28 C36 C39 C43 = C_1000p_0402_ceramic: as C12 on sheet main_pwr; package: 0402; Supplier 1: Digi-Key; Supplier Part Number 1: 445-6846-1-ND
C29 = C_1u_0603_ceramic: Ceramic capacitor, 1 uF, 0603 package; Manufacture: TDK; voltage rated: 10V; tolerance: 10%; package: 0603; Supplier 1: Digi-Key; Supplier Part Number 1: 445-1321-1-ND
C30 C34 = C_0.1u_0402_ceramic: as C19 on sheet main_ftdi; Supplier 1: Digi-Key; Supplier Part Number 1: 445-1265-1-ND; package: 0402
C31 = C_0.033u_0402_ceramic: Ceramic capacitor, 0.033 uF, 0402 package; Manufacture: TDK; voltage rated: 50 V; tolerance: 10%; Temperature Coefficient: X7R; package: 0603; Supplier 1: Digi-Key; Supplier Part Number 1: 445-7334-1-ND
C32 = C_10u_0603_ceramic: as C18 on sheet main_pwr; package: 0603; Supplier 1: Digi-Key; Supplier Part Number 1: 445-4112-1-ND
C33 = C_1u_0402_ceramic: as C21 on sheet main_ftdi; package: 0402; Supplier 1: Digi-Key; Supplier Part Number 1: 445-5000-1-ND
C35 = C_2200p_0402_ceramic: Ceramic capacitor, 2200 pF, 0402 package; Manufacture: TDK; voltage rated: 50 V; tolerance: 10%; Temperature Coefficient: X7R; package: 0402; Supplier 1: Digi-Key; Supplier Part Number 1: 445-1257-1-ND
C37 C38 C44 C45 = C_12p_0402_ceramic: Ceramic capacitor, 12 pF, 0402 package; Manufacture: Johanson; voltage rated: 50 V; tolerance: 2%; package: 0402; Supplier 1: Digi-Key; Supplier Part Number 1: 712-1256-1-ND
C40-C42 = C_100p_0402_ceramic: Ceramic capacitor, 100 pF, 0402 package; Manufacture: Kemet; voltage rated: 25 V; tolerance: 1%; package: 0402; Supplier 1: Digi-Key; Supplier Part Number 1: 399-11246-1-ND
L2 = L_15n_0402: Chip inductor, 15 nH, 0402 package; tolerance: 5%; package: 0402; Supplier 1: Digi-Key; Supplier Part Number 1: 712-1408-1-ND
L3 = L_10u_0603: Chip inductor, 10 uH, 0603 package; tolerance: 20%; package: 0402; Supplier 1: Digi-Key; Supplier Part Number 1: 445-3608-1-ND
R20 = R_2.2K_0402: as R2 on sheet main_pwr; package: 0402; Supplier 1: Digi-Key; Supplier Part Number 1: 541-2.20KLCT-ND
R21 = R_100K_0402: as R23 on sheet main_mem; Supplier 1: Digi-Key; Supplier Part Number 1: 541-100KLCT-ND; package: 0402
R22 = R_22K_0402: Chip resistor, 22K, 0402 package; tolerance: 1%; power: 1/16 W; package: 0402; Supplier 1: Digi-Key; Supplier Part Number 1: 541-22.0KLCT-ND
U1 = CC2538: as U1 on sheet main_IO; Supplier 1: Digi-Key; Supplier Part Number 1: 296-35797-1-ND
U4 = nRF8001: Single-chip Bluetooth low energy solution; Supplier 1: Digi-Key; Supplier Part Number 1: 1490-1026-ND
U5 = SN74AUP1T14: LOW POWER, 1.8/2.5/3.3-V INPUT, 3.3-V CMOS OUTPUT, SINGLE  SCHMITT-TRIGGER INVERTER GATE; Supplier 1: Digi-Key; Supplier Part Number 1: 296-27392-1-ND
U7 = uPG2214TB: GaAs Integrated Circuit for L, S-Band SPDT Switch; Supplier 1: Digi-Key; Supplier Part Number 1: UPG2214TB-E4-ACT-ND
Y2 = TSX-3225: MHz Range Crystal Unit; Load capatance: 9 pF; ESR: 60; stability: 10 ppm; Supplier 1: Digi-Key; Supplier Part Number 1: SER3628CT-ND
Y3 = FA-128: MHz Range Crystal Unit; Load capatance: 10 pF; ESR: 60; stability: 20 ppm; Supplier 1: Digi-Key; Supplier Part Number 1: SER3800CT-ND

## Sheet main_rtc.SchDoc: SDL - Main
size Letter; Author: Ye-Sheng Kuo; Revision: 1; SheetNumber: 7; SheetTotal: 8
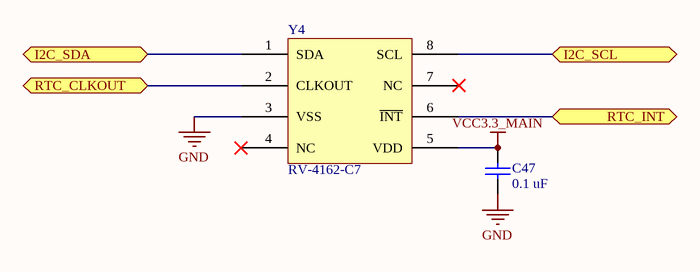
[diagram p7: main_rtc.SchDoc]

### Parts
C47  value 0.1 uF  [0402]  (hidden comment: Ceramic capacitor)
Y4  RV-4162-C7  [RV4162]

### Ports
I2C_SCL, I2C_SDA, RTC_CLKOUT, RTC_INT

### Nets
GND: C47.2 Y4.3(VSS)
VCC3.3_MAIN: C47.1 Y4.5(VDD)
I2C_SCL: Y4.8(SCL) ; port I2C_SCL
I2C_SDA: Y4.1(SDA) ; port I2C_SDA
RTC_CLKOUT: Y4.2(CLKOUT) ; port RTC_CLKOUT
RTC_INT: Y4.6(~{INT}) ; port RTC_INT

Not connected (* = marked no-connect by the designer): Y4 4(NC)* 7(NC)*

### Notes on the sheet
- Title
- Date:
- Author:
- Revision:
- Sheet
- of
- University of Michigan
- File:

### Library data of the parts
C47 = C_0.1u_0402_ceramic: as C19 on sheet main_ftdi; Supplier 1: Digi-Key; Supplier Part Number 1: 445-1265-1-ND; package: 0402
Y4 = RV-4162-C7: Real Time Clock Module with I2C Bus; Supplier 1: Newark; Supplier Part Number 1: 09X0517

## Nets that join several sheets
GND: main_connector (8 pins), main_ftdi (16 pins), main_IO (7 pins), main_mem (C46.2 U6.4 U6.9), main_pwr (26 pins), main_rf (33 pins), main_rtc (C47.2 Y4.3)
VCC3.3: main_connector (J3.1 J5.1), main_pwr (5 pins)
VCC3.3_MAIN: main_IO (10 pins), main_mem (C46.1 R23.1 R24.1 U6.8), main_pwr (24 pins), main_rf (7 pins), main_rtc (C47.1 Y4.5)
VCC3.3_USB: main_ftdi (C19.1 D1.1 U3.1 U3.16), main_pwr (U1.4)
VUSB: main_ftdi (C21.1 C22.1 FB2.2 J1.1), main_pwr (P1.3)
~{BLE_CS}: main_IO (U1.53), main_rf (U4.12)
~{BLE_RDY}: main_IO (U1.52), main_rf (U4.16)
~{BLE_RESET}: main_IO (U1.51), main_rf (R20.1)
BLE_ACTIVE: main_IO (U1.54), main_rf (U4.6)
CC2538/~{nRF8001}: main_IO (U1.50), main_rf (C39.2 U5.2 U7.6)
CC2538_RESETn: main_connector (P2.1), main_ftdi (R6.2), main_pwr (R2.2)
~{FLASH_CS}: main_IO (U1.26), main_mem (U6.1)
~{FLASH_HOLD}: main_IO (U1.25), main_mem (R23.2 U6.7)
~{FLASH_WP}: main_IO (U1.27), main_mem (R24.2 U6.3)
I2C_SCL: main_IO (R12.2 U1.31), main_rtc (Y4.8)
I2C_SDA: main_IO (R13.2 U1.30), main_rtc (Y4.1)
JTAG_TCK: main_connector (P2.4), main_pwr (U1.47)
JTAG_TMS: main_connector (P2.3), main_pwr (U1.46)
LED_Drive0: main_connector (J3.2), main_IO (U1.8)
LED_Drive1: main_connector (J3.3), main_IO (U1.48)
LED_Drive2: main_connector (J3.4), main_IO (U1.49)
Network_~{CS}: main_connector (J5.2), main_IO (U1.9)
Network_CTRL: main_connector (J5.4), main_IO (U1.12)
Network_INT: main_connector (J5.3), main_IO (U1.11)
ROM_CONTROL: main_ftdi (U3.31), main_IO (U1.18)
ROM_UART_RXD: main_ftdi (U3.30), main_IO (U1.16)
ROM_UART_TXD: main_ftdi (U3.2), main_IO (U1.17)
RTC_CLKOUT: main_IO (R14.2), main_rtc (Y4.2)
RTC_INT: main_IO (U1.29), main_rtc (Y4.6)
SPI_MISO: main_connector (J4.4), main_IO (U1.5), main_mem (U6.2), main_rf (U4.14)
SPI_MOSI: main_connector (J4.3), main_IO (U1.6), main_mem (U6.5), main_rf (U4.13)
SPI_SCK: main_connector (J4.2), main_IO (U1.7), main_mem (U6.6), main_rf (U4.11)
USB_MCU_N: main_ftdi (C25.1 R8.2), main_pwr (U1.3)
USB_MCU_P: main_ftdi (C24.1 R9.2), main_pwr (U1.2)
Vin: main_connector (J2.1 J4.1), main_pwr (P1.1)